# Altium schematic sheet IsolatedADC-OLD.SCHDOC
size A4; Organization: UNSW Solar Racing Team; Address3: UNSW; Address4: Sydney NSW 2052; Address2: Electrical Engineering; Address1: Rm 109
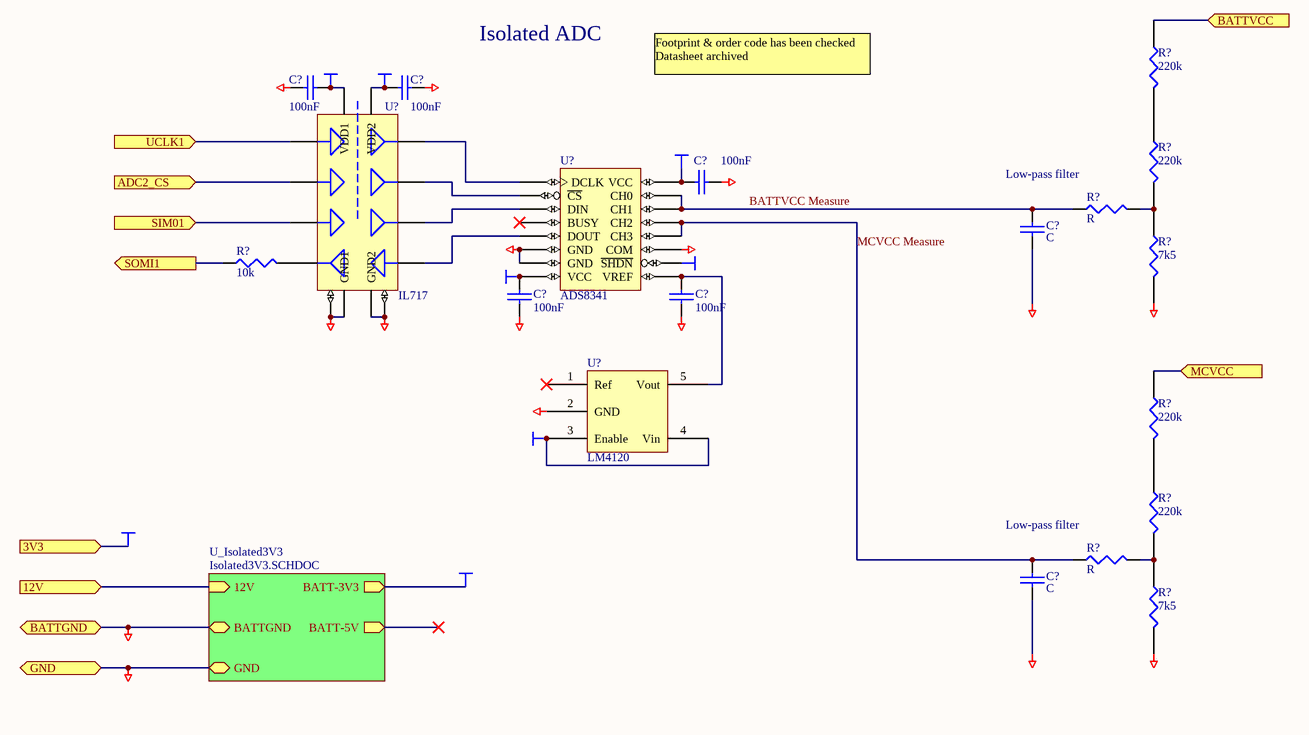
[diagram p0: IsolatedADC-OLD.SCHDOC]

## Parts
(Parts that share a designator on the sheet are numbered #1, #2 ... from top to bottom, then left to right.)
C?#1  100nF  [0603]
C?#2  100nF  [0603]
C?#3  100nF  [0603]
C?#4  C  [0603]
C?#5  100nF  [0603]
C?#6  100nF  [0603]
C?#7  C  [0603]
R?#1  220k  [1206]
R?#2  220k  [1206]
R?#3  R  [0603]
R?#4  7k5  [1206]
R?#5  10k  [0603]
R?#6  220k  [1206]
R?#7  220k  [1206]
R?#8  R  [0603]
R?#9  7k5  [1206]
U?#1  IL717  [SO16]
U?#2  ADS8341  [TSSOP16]
U?#3  LM4120  [SOT23-5]

## Sub-sheets
U_Isolated3V3 = Isolated3V3.SCHDOC: 12V (in), GND (bidir), BATTGND (bidir), BATT-3V3 (out), BATT-5V (out)

## Ports
3V3 (in), 12V (in), ADC2_CS (in), BATTGND (bidir), BATTVCC (in), GND (bidir), MCVCC (in), SIM01 (in), SOMI1 (out), UCLK1 (in)

## Nets
3V3: C?#1.1 U?#1.1(VDD1) ; port 3V3
BATT-3V3: C?#2.1 C?#3.1 C?#6.2 U?#1.16(VDD2) U?#2.1(VCC) U?#2.7(~{SHDN}) U?#2.9(VCC) U?#3.3(Enable) U?#3.4(Vin) ; sheet U_Isolated3V3/BATT-3V3
BATTGND: C?#2.2 C?#3.2 C?#4.2 C?#5.2 C?#6.1 C?#7.2 R?#4.2 R?#9.2 U?#1.9(GND2) U?#1.15(GND2) U?#2.6(COM) U?#2.10(GND) U?#2.11(GND) U?#3.2(GND) ; port BATTGND, sheet U_Isolated3V3/BATTGND
GND: C?#1.2 U?#1.2(GND1) U?#1.8(GND1) ; port GND, sheet U_Isolated3V3/GND
12V: port 12V, sheet U_Isolated3V3/12V
ADC2_CS: U?#1.4(IN2) ; port ADC2_CS
BATTVCC: R?#1.1 ; port BATTVCC
BATTVCC Measure: C?#4.1 R?#3.1 U?#2.2(CH0) U?#2.3(CH1)
MCVCC: R?#6.1 ; port MCVCC
MCVCC Measure: C?#7.1 R?#8.1 U?#2.4(CH2) U?#2.5(CH3)
SIM01: U?#1.5(IN3) ; port SIM01
SOMI1: R?#5.1 ; port SOMI1
UCLK1: U?#1.3(IN1) ; port UCLK1
NetC?#5_1: C?#5.1 U?#2.8(VREF) U?#3.5(Vout)
NetR?#1_2: R?#1.2 R?#2.1
NetR?#2_2: R?#2.2 R?#3.2 R?#4.1
NetR?#5_2: R?#5.2 U?#1.6(OUT4)
NetR?#6_2: R?#6.2 R?#7.1
NetR?#7_2: R?#7.2 R?#8.2 R?#9.1
NetU?#1_11: U?#1.11(IN4) U?#2.12(DOUT)
NetU?#1_12: U?#1.12(OUT3) U?#2.14(DIN)
NetU?#1_13: U?#1.13(OUT2) U?#2.15(~{CS})
NetU?#1_14: U?#1.14(OUT1) U?#2.16(DCLK)

Not connected (* = marked no-connect by the designer): U?#2 13(BUSY)*; U?#3 1(Ref)*

## Notes on the sheet
- Isolated ADC
- Footprint & order code has been checked
  Datasheet archived
- Low-pass filter
- Title
- Size:
- Date:
- A4
- Number:
- Time:
- Revision:
- Sheet
- of
- File:

## Library data of the parts
C?#1-C?#7 = CAP: Capacitor
  C?#1-C?#3 C?#5 C?#6: Farnell: 753-567; Price: 0.31
  C?#4 C?#7: Farnell: ?
R?#1 R?#2 R?#4 R?#6 R?#7 R?#9 = RES1: Price: 1.010
  R?#1 R?#2 R?#6 R?#7: Farnell: 308-9587
  R?#4 R?#9: Farnell: 308-6150
R?#3 R?#5 R?#8 = RES1: Resistor
  R?#3 R?#8: Farnell: ?
  R?#5: Farnell: 612-601; Price: 0.11
U?#1 = IL717: Isoloop IL717 - www.nve.com; Farnell: 9570659; Price: 19.20
U?#3 = LM4120: Precision LDO voltage reference; Farnell: 9778802; Price: 5.10
U?#2 = ADS8341: Farnell: 1212292; Price: 27.40